# EAGLE design smartwatch class 2_justincase (EAGLE 9.6.2)
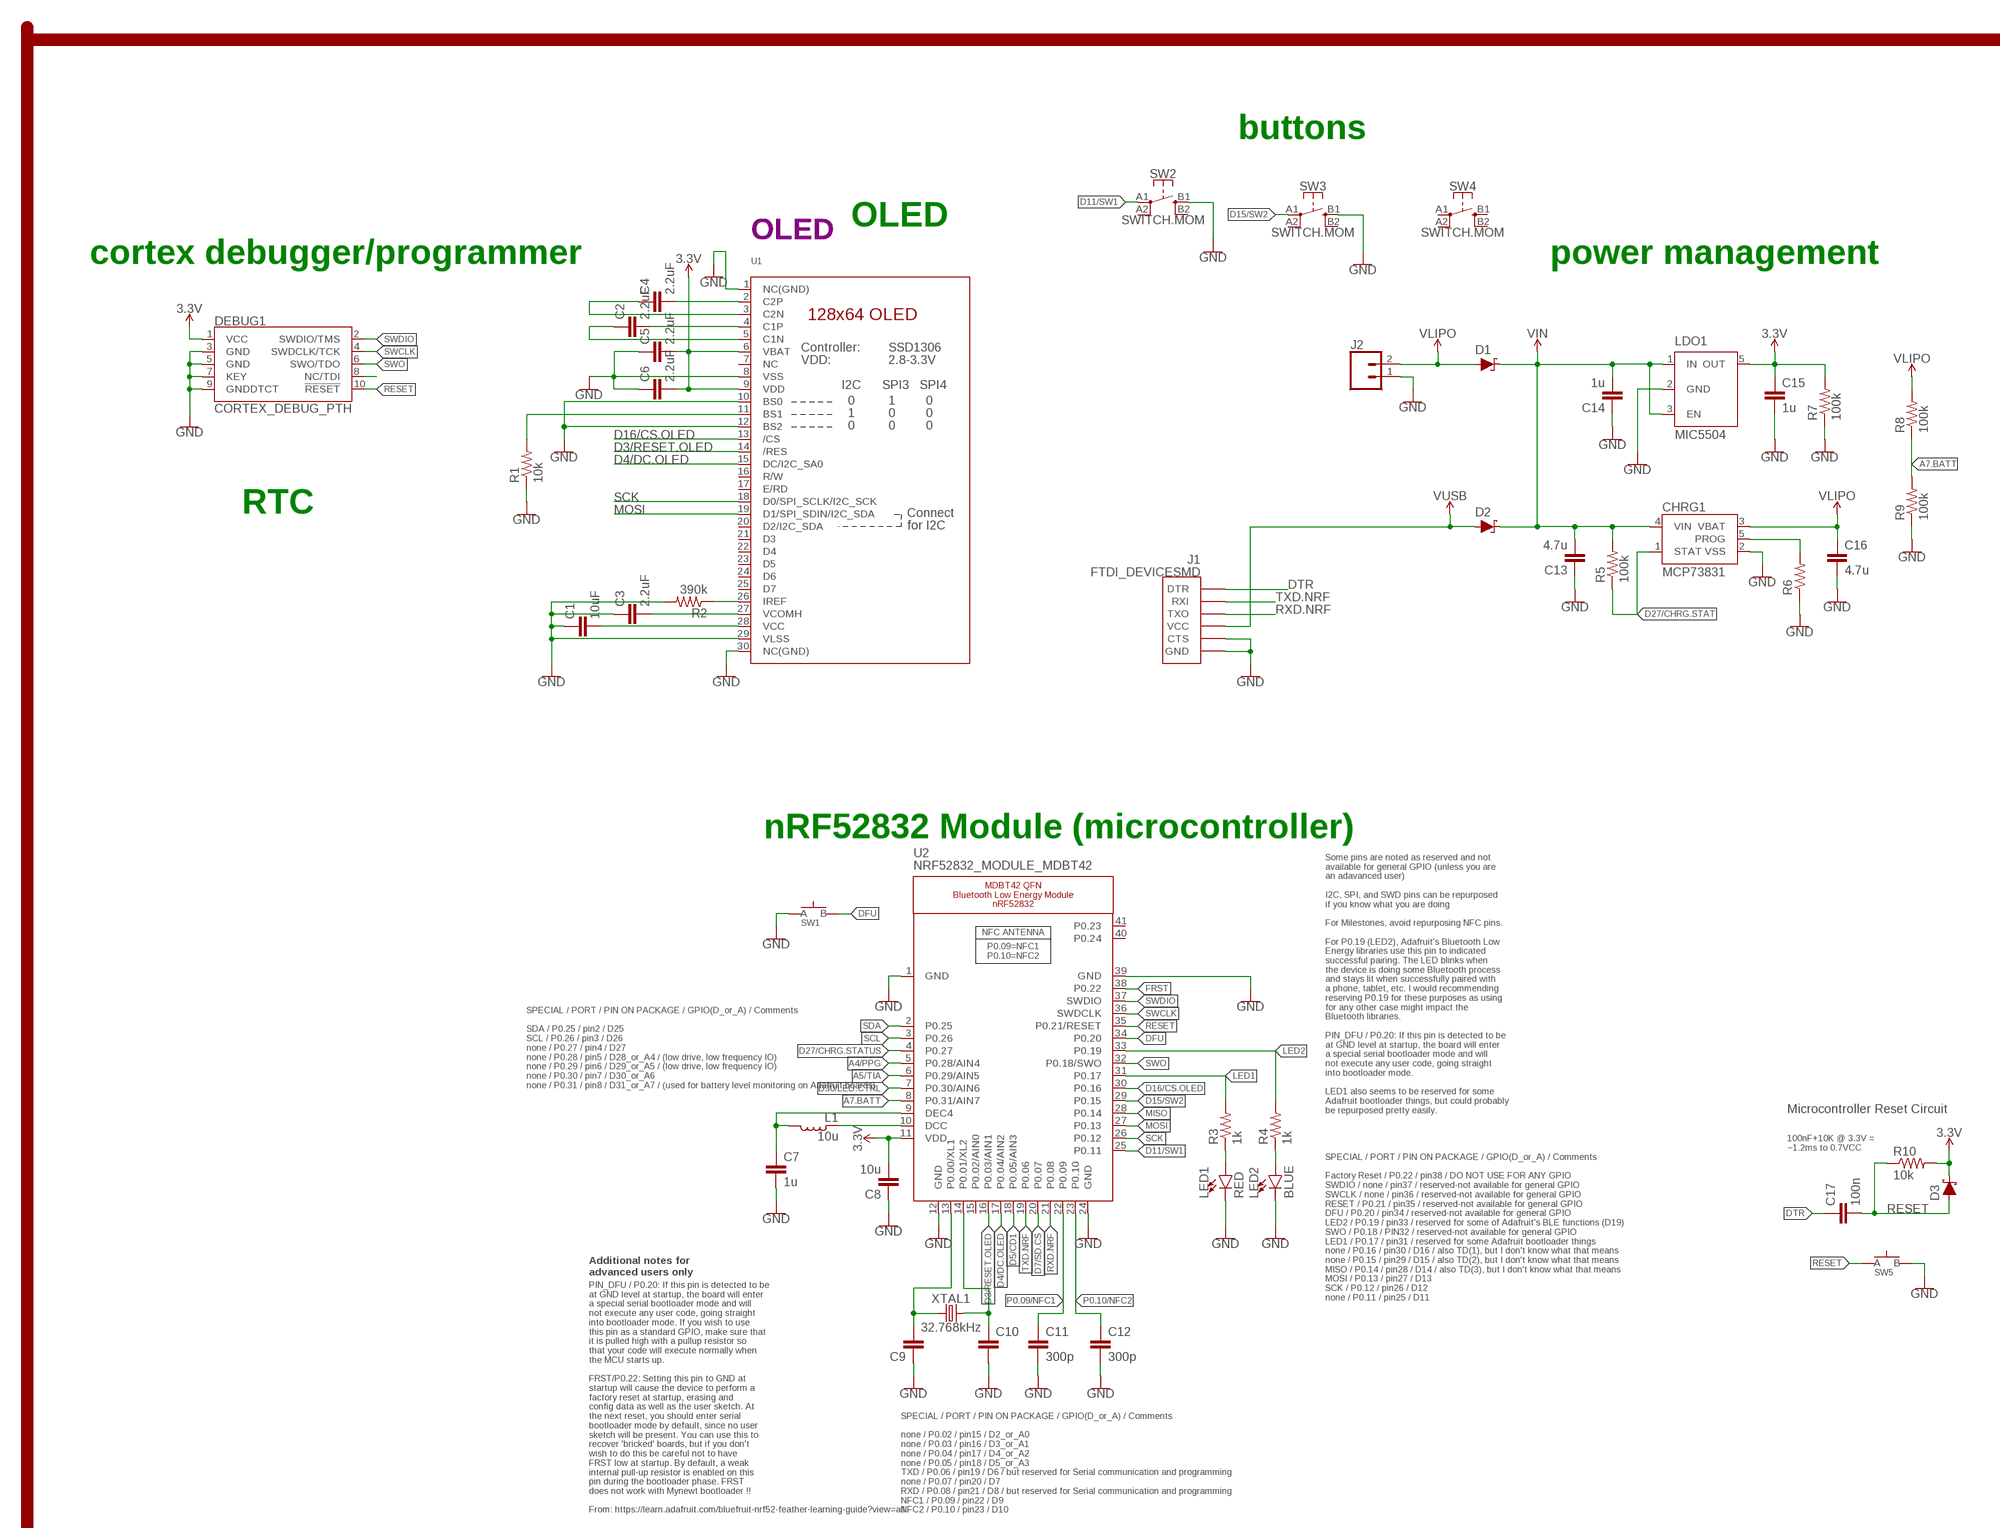
[diagram p0: schematic, sheet 1, part 1 of 2]
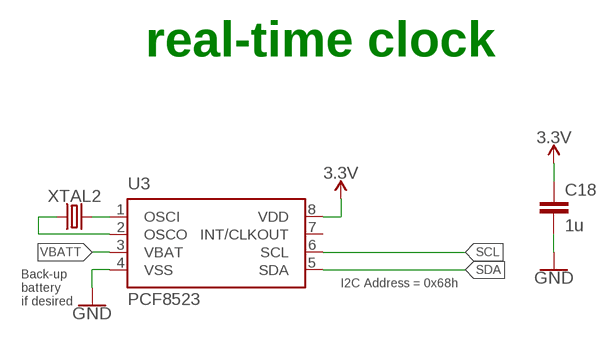
[diagram p1: schematic, sheet 1, part 2 of 2]

## Parts
C1  10uF  CAPACITOR0603  [C0603]
C2  2.2uF  CAPACITOR0603  [C0603]
C3  2.2uF  CAPACITOR0603  [C0603]
C4  2.2uF  CAPACITOR0603  [C0603]
C5  2.2uF  CAPACITOR0603  [C0603]
C6  2.2uF  CAPACITOR0603  [C0603]
C7  1u  CAPACITOR0603  [C0603]
C8  10u  CAPACITOR0805  [C0805]
C9  CAPACITOR0603  [C0603]
C10  CAPACITOR0603  [C0603]
C11  300p  CAPACITOR0603  [C0603]
C12  300p  CAPACITOR0603  [C0603]
C13  4.7u  CAPACITOR0603  [C0603]
C14  1u  CAPACITOR0603  [C0603]
C15  1u  CAPACITOR0603  [C0603]
C16  4.7u  CAPACITOR0603  [C0603]
C17  100n  CAPACITOR0603  [C0603]
C18  1u  CAPACITOR0603  [C0603]
CHRG1  MCP73831  [SOT23-5]
D1  SCHOTTKY-USC  [USC]
D2  SCHOTTKY-USC  [USC]
D3  SCHOTTKY-USC  [USC]
DEBUG1  CORTEX_DEBUG_PTH  [2X5-PTH-1.27MM]
J1  FTDI_DEVICESMD  [FTDI-SMD]
J2  CONN_02  [1X02]
L1  10u  INDUCTOR0603  [L0603]
LDO1  MIC5504  [SOT23-5]
LED1  RED  LED0603  [LED-0603]
LED2  BLUE  LED0603  [LED-0603]
R1  10k  RESISTOR0603  [R0603]
R2  390k  RESISTOR0603  [R0603]
R3  1k  RESISTOR0603  [R0603]
R4  1k  RESISTOR0603  [R0603]
R5  100k  RESISTOR0603  [R0603]
R6  RESISTOR0603  [R0603]
R7  100k  RESISTOR0603  [R0603]
R8  100k  RESISTOR0603  [R0603]
R9  100k  RESISTOR0603  [R0603]
R10  10k  RESISTOR0603  [R0603]
SW1  SPST-PTS830GG140-COPY.1-3  [BUTTON-GULLWING]
SW2  SWITCH.MOM  [TACTILE_SWITCH_SMD_6.2MM_TALL]
SW3  SWITCH.MOM  [TACTILE_SWITCH_SMD_6.2MM_TALL]
SW4  SWITCH.MOM  [TACTILE_SWITCH_SMD_6.2MM_TALL]
SW5  SPST-PTS830GG140-COPY.1-3  [BUTTON-GULLWING]
U1  DISP_OLED_UG-2864HSWEG01-NO-WRAPAROUND  [UG-2864HSWEG01_0.96IN_NO-WRAPAROUND]
U2  NRF52832_MODULE_MDBT42  [BLE_MODULE_RAYTAC_MDBT42]
U3  PCF8523  [SO8]
XTAL1  32.768kHz  CRYSTALECS-.327-12.5-12-C-TR  [2-SMD.NOLEAD.2.0MMTO1.2MM]
XTAL2  32.7680kHz  CRYSTALECS-.327-12.5-12-C-TR  [2-SMD.NOLEAD.2.0MMTO1.2MM]

## Nets
3.3V: C5.2 C6.2 C8.2 C15.1 C18.1 D3.-(C) DEBUG1.1(VCC) LDO1.5(OUT) R7.2 R10.2 U1.6(VBAT) U1.9(VDD) U2.11(VDD) U3.8(VDD)
A4/PPG: U2.5(P0.28/AIN4)
A5/TIA: U2.6(P0.29/AIN5)
A7.BATT: R8.1 R9.2 U2.8(P0.31/AIN7)
D3/RESET.OLED: U1.14(/RES) U2.16(P0.03/AIN1)
D4/DC.OLED: U1.15(DC/I2C_SA0) U2.17(P0.04/AIN2)
D5/CD1: U2.18(P0.05/AIN3)
D7/SD.CS: U2.20(P0.07)
D11/SW1: SW2.A1 U2.25(P0.11)
D15/SW2: SW3.A1 U2.29(P0.15)
D16/CS.OLED: U1.13(/CS) U2.30(P0.16)
D27/CHRG.STAT: CHRG1.1(STAT) R5.1
D27/CHRG.STATUS: U2.4(P0.27)
D30/LED.CTRL: U2.7(P0.30/AIN6)
DFU: SW1.3(B) U2.34(P0.20)
DTR: C17.1 J1.DTR
FRST: U2.38(P0.22)
GND: C1.1 C3.1 C5.1 C6.1 C7.2 C8.1 C9.1 C10.2 C11.2 C12.2 C13.1 C14.1 C15.2 C16.2 C18.2 CHRG1.2(VSS) DEBUG1.3(GND) DEBUG1.5(GND) DEBUG1.7(KEY) DEBUG1.9(GNDDTCT) J1.CTS J1.GND J2.1 LDO1.2(GND) LED1.C LED2.C R1.1 R2.2 R6.1 R7.1 R9.1 SW1.1(A) SW2.B1 SW3.B1 SW5.3(B) U1.1(NC(GND)) U1.8(VSS) U1.10(BS0) U1.12(BS2) U1.29(VLSS) U1.30(NC(GND)) U2.1(GND) U2.12(GND) U2.24(GND) U2.39(GND) U3.4(VSS)
LED1: R3.2 U2.31(P0.17)
LED2: R4.2 U2.33(P0.19)
MISO: U2.28(P0.14)
MOSI: U1.19(D1/SPI_SDIN/I2C_SDA) U2.27(P0.13)
N$1: C9.2 U2.13(P0.00/XL1) XTAL1.P$1
N$2: C10.1 U2.14(P0.01/XL2) XTAL1.P$2
N$3: L1.1 U2.10(DCC)
N$4: R1.2 U1.11(BS1)
N$5: LED1.A R3.1
N$6: R2.1 U1.26(IREF)
N$7: LED2.A R4.1
N$8: C7.1 L1.2 U2.9(DEC4)
N$9: C4.2 U1.2(C2P)
N$10: C4.1 U1.3(C2N)
N$11: C2.2 U1.4(C1P)
N$12: C2.1 U1.5(C1N)
N$13: DEBUG1.8(NC/TDI)
N$14: C1.2 U1.28(VCC)
N$15: C3.2 U1.27(VCOMH)
N$17: CHRG1.5(PROG) R6.2
N$19: U3.2(OSCO) XTAL2.P$1
N$20: U3.1(OSCI) XTAL2.P$2
P0.09/NFC1: C11.1 U2.22(P0.09)
P0.10/NFC2: C12.1 U2.23(P0.10)
RESET: C17.2 D3.+(A) DEBUG1.10(!RESET) R10.1 SW5.1(A) U2.35(P0.21/RESET)
RXD.NRF: J1.TXO U2.21(P0.08)
SCK: U1.18(D0/SPI_SCLK/I2C_SCK) U2.26(P0.12)
SCL: U2.3(P0.26) U3.6(SCL)
SDA: U2.2(P0.25) U3.5(SDA)
SWCLK: DEBUG1.4(SWDCLK/TCK) U2.36(SWDCLK)
SWDIO: DEBUG1.2(SWDIO/TMS) U2.37(SWDIO)
SWO: DEBUG1.6(SWO/TDO) U2.32(P0.18/SWO)
TXD.NRF: J1.RXI U2.19(P0.06)
V_USB: D2.+(A) J1.VCC ; supply symbol labelled VUSB
VBATT: U3.3(VBAT)
VIN: C13.2 C14.2 CHRG1.4(VIN) D1.-(C) D2.-(C) LDO1.1(IN) LDO1.3(EN) R5.2
VLIPO: C16.1 CHRG1.3(VBAT) D1.+(A) J2.2 R8.2
Unconnected: SW2.A2 SW2.B2 SW3.A2 SW3.B2 SW4.A1 SW4.A2 SW4.B1 SW4.B2 U1.7(NC) U1.16(R/W) U1.17(E/RD) U1.20(D2/I2C_SDA) U1.21(D3) U1.22(D4) U1.23(D5) U1.24(D6) U1.25(D7) U2.15(P0.02/AIN0) U2.40(P0.24) U2.41(P0.23) U3.7(INT/CLKOUT)

## Notes on the sheet
- buttons
- OLED
- OLED
- cortex debugger/programmer | power management
- RTC
- real-time clock
- nRF52832 Module (microcontroller)
- I2C Address = 0x68h
- Back-up
  battery
  if desired
- SPECIAL / PORT / PIN ON PACKAGE / GPIO(D_or_A) / Comments
  
  SDA / P0.25 / pin2 / D25
  SCL / P0.26 / pin3 / D26
  none / P0.27 / pin4 / D27
  none / P0.28 / pin5 / D28_or_A4 / (low drive, low frequency IO)
  none / P0.29 / pin6 / D29_or_A5 / (low drive, low frequency IO)
  none / P0.30 / pin7 / D30_or_A6
  none / P0.31 / pin8 / D31_or_A7 / (used for battery level monitoring on Adafruit boards)
- Some pins are noted as reserved and not
  available for general GPIO (unless you are
  an adavanced user)
  
  I2C, SPI, and SWD pins can be repurposed
  if you know what you are doing
  
  For Milestones, avoid repurposing NFC pins.
  
  For P0.19 (LED2), Adafruit's Bluetooth Low
  Energy libraries use this pin to indicated
  successful pairing. The LED blinks when
  the device is doing some Bluetooth process
  and stays lit when successfully paired with
  a phone, tablet, etc. I would recommending
  reserving P0.19 for these purposes as using
  for any other case might impact the
  Bluetooth libraries.
  
  PIN_DFU / P0.20: If this pin is detected to be
  at GND level at startup, the board will enter
  a special serial bootloader mode and will
  not execute any user code, going straight
  into bootloader mode.
  
  LED1 also seems to be reserved for some
  Adafruit bootloader things, but could probably
  be repurposed pretty easily.
- Microcontroller Reset Circuit
- 100nF+10K @ 3.3V =
  ~1.2ms to 0.7VCC
- Additional notes for
  advanced users only
- SPECIAL / PORT / PIN ON PACKAGE / GPIO(D_or_A) / Comments
  
  Factory Reset / P0.22 / pin38 / DO NOT USE FOR ANY GPIO
  SWDIO / none / pin37 / reserved-not available for general GPIO
  SWCLK / none / pin36 / reserved-not available for general GPIO
  RESET / P0.21 / pin35 / reserved-not available for general GPIO
  DFU / P0.20 / pin34 / reserved-not available for general GPIO
  LED2 / P0.19 / pin33 / reserved for some of Adafruit's BLE functions (D19)
  SWO / P0.18 / PIN32 / reserved-not available for general GPIO
  LED1 / P0.17 / pin31 / reserved for some Adafruit bootloader things
  none / P0.16 / pin30 / D16 / also TD(1), but I don't know what that means
  none / P0.15 / pin29 / D15 / also TD(2), but I don't know what that means
  MISO / P0.14 / pin28 / D14 / also TD(3), but I don't know what that means
  MOSI / P0.13 / pin27 / D13
  SCK / P0.12 / pin26 / D12
  none / P0.11 / pin25 / D11
- PIN_DFU / P0.20: If this pin is detected to be
  at GND level at startup, the board will enter
  a special serial bootloader mode and will
  not execute any user code, going straight
  into bootloader mode. If you wish to use
  this pin as a standard GPIO, make sure that
  it is pulled high with a pullup resistor so
  that your code will execute normally when
  the MCU starts up.
  
  FRST/P0.22: Setting this pin to GND at
  startup will cause the device to perform a
  factory reset at startup, erasing and
  config data as well as the user sketch. At
  the next reset, you should enter serial
  bootloader mode by default, since no user
  sketch will be present. You can use this to
  recover 'bricked' boards, but if you don't
  wish to do this be careful not to have
  FRST low at startup. By default, a weak
  internal pull-up resistor is enabled on this
  pin during the bootloader phase. FRST
  does not work with Mynewt bootloader !!
  
  From: https://learn.adafruit.com/bluefruit-nrf52-feather-learning-guide?view=all
- SPECIAL / PORT / PIN ON PACKAGE / GPIO(D_or_A) / Comments
  
  none / P0.02 / pin15 / D2_or_A0
  none / P0.03 / pin16 / D3_or_A1
  none / P0.04 / pin17 / D4_or_A2
  none / P0.05 / pin18 / D5_or_A3
  TXD / P0.06 / pin19 / D6 / but reserved for Serial communication and programming
  none / P0.07 / pin20 / D7
  RXD / P0.08 / pin21 / D8 / but reserved for Serial communication and programming
  NFC1 / P0.09 / pin22 / D9
  NFC2 / P0.10 / pin23 / D10

## Library data of the parts
C1-C18 = LinnesLab-Passives:CAPACITOR
CHRG1 = LinnesLab-Power:MCP73831: MCP73831T Li-Ion, Li-Pol Controller Miniature single cell, fully integrated Li-Ion, Li-polymer charge management controller Datasheet <http://ww1.microchip.com/downloads/en/DeviceDoc/20001984g.pdf> SparkFun Products: SparkFun ESP32 Thing <https://www.sparkfun.com/products/13907> SparkFun 9DoF Razor IMU M0 <https://www.sparkfun.com/products/14001>; PROD_ID: IC-09995
D1-D3 = LinnesLab-DiscreteSemi:SCHOTTKY: Schottky diode A Schottky diode is a semiconductor diode which has a low forward voltage drop and a very fast switching action. Example: Digi-Key Part Number: RB161MM-20CT-ND
DEBUG1 = LinnesLab-Connectors:CORTEX_DEBUG: Cortex Debug Connector - 10 pin Supports JTAG debug, Serial Wire debug, and Serial Wire Viewer. PTH and SMD connector options available. General Connector Information <http://infocenter.arm.com/help/topic/com.arm.doc.faqs/attached/13634/cortex_debug_connectors.pdf> Products: PTH Connector <http://www.digikey.com/product-detail/en/cnc-tech/3220-10-0100-00/1175-1627-ND/3883661> -via Digi-Key SparkFun PSoc <https://www.sparkfun.com/products/13229> SparkFun T <https://www.sparkfun.com/products/13810>
J1 = LinnesLab-Connectors:FTDI_DEVICE
J2 = LinnesLab-Connectors:CONN_02: Multi connection point. Often used as Generic Header-pin footprint for 0.1 inch spaced/style header connections On any of the 0.1 inch spaced packages, you can populate with these: Break Away Headers - Straight <https://www.sparkfun.com/products/116> (PRT-00116) Break Away Male Headers - Right Angle <https://www.sparkfun.com/products/553> (PRT-00553) Female Headers <https://www.sparkfun.com/products/115> (PRT-00115) Break Away Headers - Machine Pin <https://www.sparkfun.com/products/117> (PRT-00117) Break Away Female Headers - Swiss Machine Pin <https://www.sparkfun.com/products/743> (PRT-00743) For SCREWTERMINALS and SPRING TERMINALS visit here: Screw Terimnals on SparkFun.com <https://www.sparkfun.com/search/results?term=Screw+Terminals> (5mm/3.5mm/2.54mm spacing) This device is also useful as a general connection point to wire up your design to another part of your project. Our various solder wires solder well into these plated through hole pads. Hook-Up Wire - Assortment (Stranded, 22 AWG) <https://www.sparkfun.com/products/11375> (PRT-11375) Hook-Up Wire - Assortment (Solid Core, 22 AWG) <https://www.sparkfun.com/products/11367> (PRT-11367) View the entire wire category on our website here <https://www.sparkfun.com/categories/141> Special notes: Molex polarized connector foot print use with: PRT-08233 with associated crimp pins and housings. 2.54_SCREWTERM for use with PRT-10571. 3.5mm Screw Terminal footprints for PRT-08084 5mm Screw Terminal footprints for use with PRT-08432
L1 = LinnesLab-Passives:INDUCTOR
LDO1 = LinnesLab-Power:MIC5504: MIC5504 Voltage Regulator Output Voltages: 1.0V to 3.3V Input Voltages: 2.5V to 5.5V Link to Datasheet http://ww1.microchip.com/downloads/en/DeviceDoc/MIC550X.pdf
LED1 LED2 = LinnesLab-LED:LED: LED (Generic) Standard schematic elements and footprints for 5mm, 3mm, 1206, and 0603 sized LEDs. Generic LEDs with no color specified. LTST-C190KGKT: arrow indicates cathode
R1-R10 = LinnesLab-Passives:RESISTOR
SW1 SW5 = LinnesLab-Switches:SPST-PTS830GG140-COPY
SW2-SW4 = LinnesLab-Switches:SWITCH.MOM: PTS645SM43SMTR92 LFS
U1 = LinnesLab-Displays:DISP_OLED_UG-2864HSWEG01: UG-2864HSWEG01 OLED display Both 1.3" and 0.96" models share the same FPC tab footprint, only the screen dimensions vary.
U2 = LinnesLab-Microcontrollers:NRF52832_MODULE_MDBT42: MDBT42 - BLE Module (nRF52832 QFN) VDD: 1.7-3.6V
U3 = LinnesLab-Clocks:PCF8523; DIGIKEY: 568-5306-1-ND; I2C_ADDRESS: 0x68h; MFN: PCF8523T/1,118; MFN_MANUFACTURER: NXP USA Inc.
XTAL1 XTAL2 = LinnesLab-Clocks:CRYSTAL; DIGIKEY: XC2288CT-ND; FREQ: 32.7680KHZ; LOAD_CAP: 12.5pF

## Board
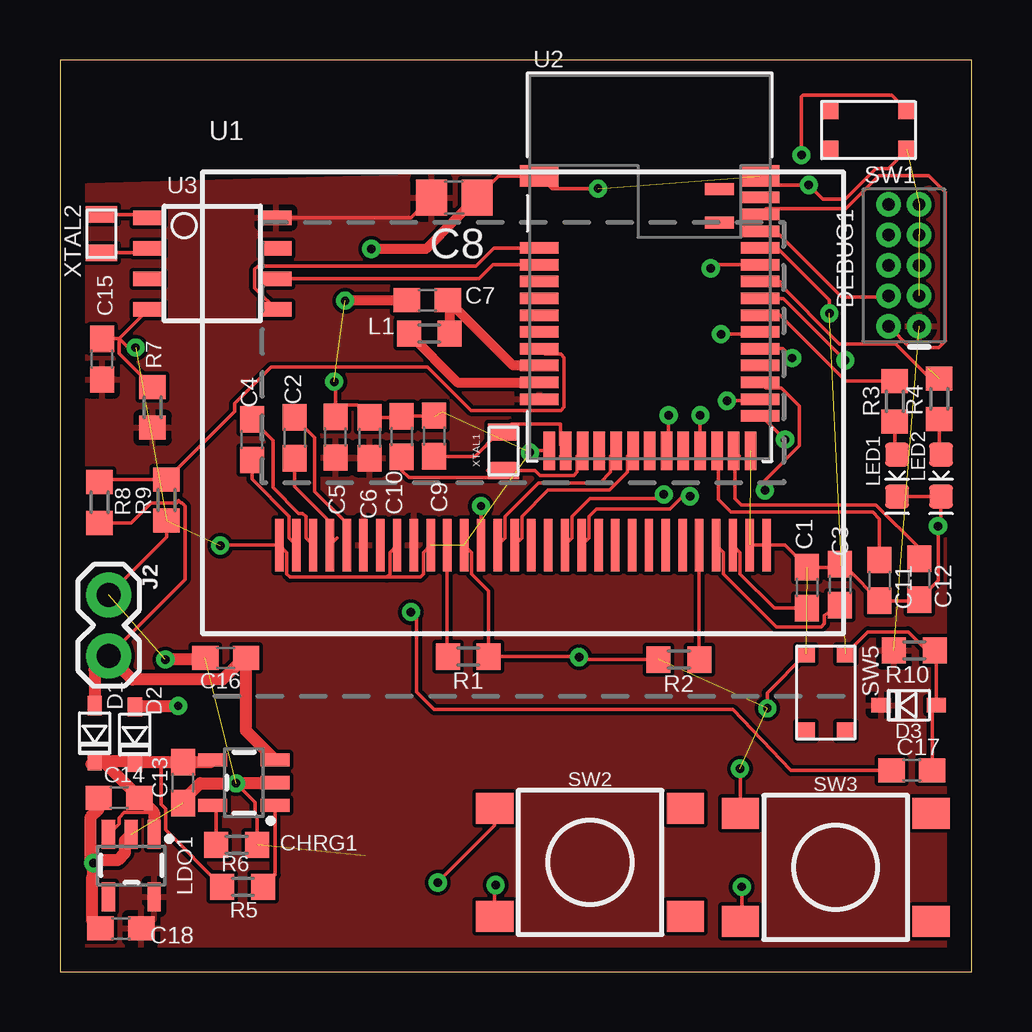
[diagram p2: board, top side]
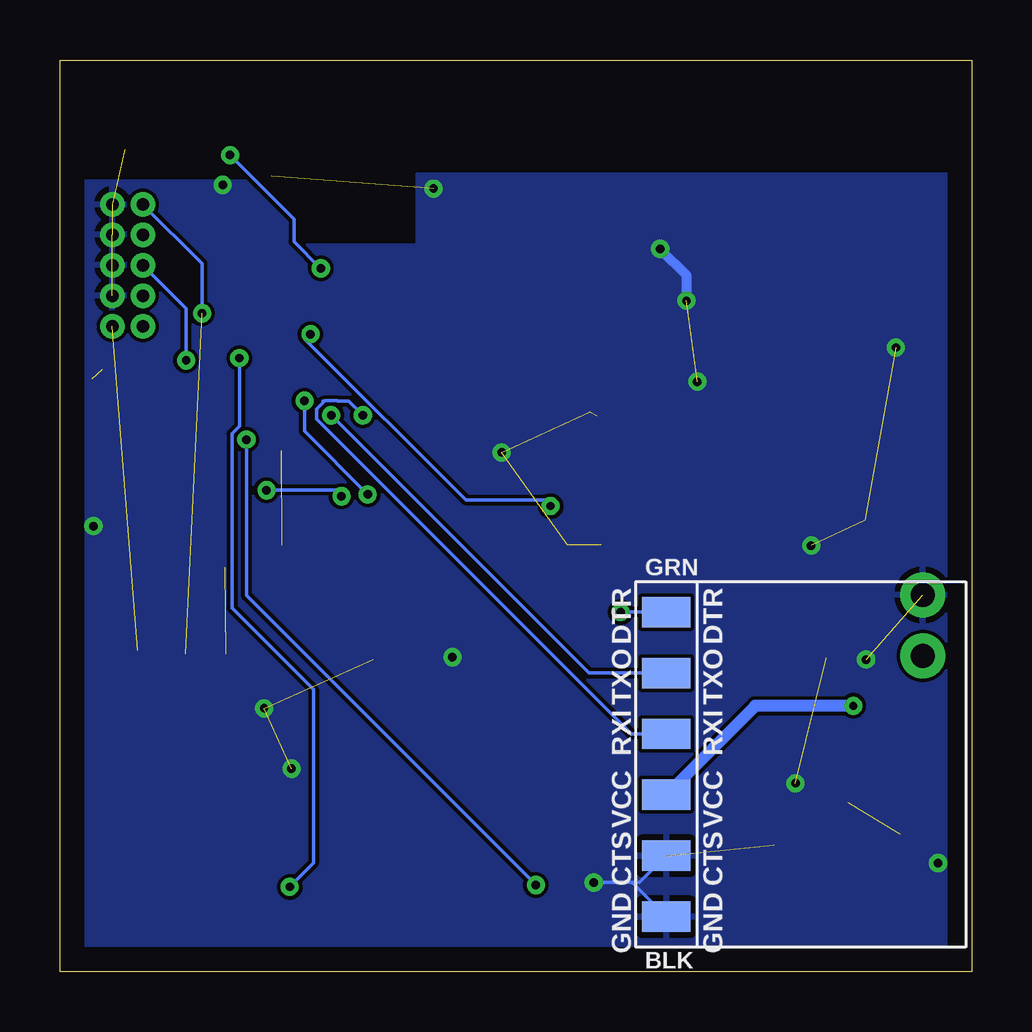
[diagram p3: board, bottom side, seen from below]

Size 38 x 38 mm. Coordinates in mm from the lower left corner, seen from the top.
Outline: 0,0 38,0 38,38 0,38 0,0
Copper layers (1*16): Top 0.035mm / dielectric 1.5mm / Bottom 0.035mm
Design rules "default": minimum track width 6mil, minimum drill 0.35mm, track to track 6mil, track to pad 6mil, pad to pad 6mil, via to via 6mil, smd to smd 6mil, copper to edge 40mil, drill to drill 6mil, minimum pad ring 10mil, minimum via ring 8mil, stop-mask expansion 4mil, vias tented up to drill 0mil, thermal gap 10mil

### Footprints (pad centres in the part's own frame; a part is rotated, then mirrored left to right if it is on the bottom)
C0603 = smd 1.1 x 1: 1 -0.85,0; 2 0.85,0
C0805 = smd 1.3 x 1.5: 1 -0.95,0; 2 0.95,0
SOT23-5 = smd 0.55 x 1.2: 1 -0.95,-1.3; 2 0,-1.3; 3 0.95,-1.3; 4 0.95,1.3; 5 -0.95,1.3
USC = smd 0.8 x 0.6: + -1.15,0; - 1.15,0
2X5-PTH-1.27MM = drill 0.508 pad 1: 1 -2.54,-0.635; 2 -2.54,0.635; 3 -1.27,-0.635; 4 -1.27,0.635; 5 0,-0.635; 6 0,0.635; 7 1.27,-0.635; 8 1.27,0.635; 9 2.54,-0.635; 10 2.54,0.635
FTDI-SMD = smd 1.27 x 2.03: CTS 3.81,0; DTR -6.35,0; GND 6.35,0; RXI -1.27,0; TXO -3.81,0; VCC 1.27,0
1X02 = drill 1.016 pad 1.88: 1 0,0; 2 2.54,0
L0603 = smd 1 x 1.1: 1 -0.85,0; 2 0.85,0
LED-0603 = smd 1 x 1: A -0.877,0; C 0.877,0
R0603 = smd 1 x 1.1: 1 -0.85,0; 2 0.85,0
BUTTON-GULLWING = smd 0.7 x 0.75: 1 -1.6,0.825; 2 1.6,0.825; 3 -1.6,-0.825; 4 1.6,-0.825
TACTILE_SWITCH_SMD_6.2MM_TALL = smd 1.55 x 1.3: A1 -3.975,-2.25; A2 3.975,-2.25; B1 -3.975,2.25; B2 3.975,2.25
UG-2864HSWEG01_0.96IN_NO-WRAPAROUND = smd 0.35 x 2.2: 1 -10.15,-1.2; 2 -9.45,-1.2; 3 -8.75,-1.2; 4 -8.05,-1.2; 5 -7.35,-1.2; 6 -6.65,-1.2; 7 -5.95,-1.2; 8 -5.25,-1.2; 9 -4.55,-1.2; 10 -3.85,-1.2; 11 -3.15,-1.2; 12 -2.45,-1.2; 13 -1.75,-1.2; 14 -1.05,-1.2; 15 -0.35,-1.2; 16 0.35,-1.2; 17 1.05,-1.2; 18 1.75,-1.2; 19 2.45,-1.2; 20 3.15,-1.2; 21 3.85,-1.2; 22 4.55,-1.2; 23 5.25,-1.2; 24 5.95,-1.2; 25 6.65,-1.2; 26 7.35,-1.2; 27 8.05,-1.2; 28 8.75,-1.2; 29 9.45,-1.2; 30 10.15,-1.2
BLE_MODULE_RAYTAC_MDBT42 = smd 1.6 x 0.9: 1 -4.6,3.8; 39 4.6,3.8 | smd 1.6 x 0.48: 2 -4.6,0.8; 3 -4.6,0.1; 4 -4.6,-0.6; 5 -4.6,-1.3; 6 -4.6,-2; 7 -4.6,-2.7; 8 -4.6,-3.4; 9 -4.6,-4.1; 10 -4.6,-4.8; 11 -4.6,-5.5; 25 4.6,-6.2; 26 4.6,-5.5; 27 4.6,-4.8; 28 4.6,-4.1; 29 4.6,-3.4; 30 4.6,-2.7; 31 4.6,-2; 32 4.6,-1.3; 33 4.6,-0.6; 34 4.6,0.1; 35 4.6,0.8; 36 4.6,1.5; 37 4.6,2.2; 38 4.6,2.9 | smd 0.48 x 1.6: 12 -4.2,-7.65; 13 -3.5,-7.65; 14 -2.8,-7.65; 15 -2.1,-7.65; 16 -1.4,-7.65; 17 -0.7,-7.65; 18 0,-7.65; 19 0.7,-7.65; 20 1.4,-7.65; 21 2.1,-7.65; 22 2.8,-7.65; 23 3.5,-7.65; 24 4.2,-7.65 | smd 1.2 x 0.5: 40 2.9,3.25; 41 2.9,1.85
SO8 = smd 1.3 x 0.6: 1 -2.65,1.905; 2 -2.65,0.635; 3 -2.65,-0.635; 4 -2.65,-1.905; 5 2.65,-1.905; 6 2.65,-0.635; 7 2.65,0.635; 8 2.65,1.905
2-SMD.NOLEAD.2.0MMTO1.2MM = smd 0.7 x 1.3: P$1 -0.8,0; P$2 0.8,0

### Placement (x,y rotation side)
C1  31.14,16 270 top
C2  9.78,22.25 270 top
C3  32.51,16.13 270 top
C4  8,22.17 270 top
C5  11.48,22.28 270 top
C6  12.9,22.25 270 top
C7  15.32,27.99 180 top
C8  16.43,32.26 180 top
C9  15.6,22.33 270 top
C10  14.25,22.3 90 top
C11  34.16,16.31 270 top
C12  35.81,16.36 270 top
C13  5.13,7.87 90 top
C14  2.46,7.24 0 top
C15  1.75,25.53 90 top
C16  6.91,13.08 180 top
C17  35.51,8.38 0 top
C18  2.54,1.8 180 top
CHRG1  7.67,7.87 90 top
D1  1.45,9.93 270 top
D2  3.12,9.88 270 top
D3  35.38,11.1 180 top
DEBUG1  35.18,29.44 90 top
J1  12.73,8.64 270 bottom
J2  2.03,15.7 270 top
L1  15.39,26.59 0 top
LDO1  2.97,4.42 180 top
LED1  34.9,20.68 270 top
LED2  36.73,20.68 270 top
R1  17.02,13.13 180 top
R2  25.81,13 180 top
R3  34.8,23.77 90 top
R4  36.65,23.88 90 top
R5  7.62,3.53 180 top
R6  7.37,5.28 180 top
R7  3.86,23.52 270 top
R8  1.65,19.56 270 top
R9  4.45,19.66 90 top
R10  35.61,13.39 180 top
SW1  33.71,35.08 180 top
SW2  22.1,4.55 0 top
SW3  32.33,4.34 0 top
SW4  38.71,-6.99 0 top  (outside the outline)
SW5  31.93,11.63 270 top
U1  19.3,18.97 0 top
U2  24.59,29.36 0 top
U3  6.35,29.51 0 top
XTAL1  18.49,21.69 270 top
XTAL2  1.73,30.76 90 top

### Tracks (layer width: path | path; a pad name or v marks a point on that pad's centre or on a via)
3.3V  (1 unrouted)
  Top 0.152: C8.2 14.65,31.42 U3.8
  pour Top: 23.24,33.41 23.24,30.35 28.17,30.35 37.82,33.17 37.82,0.41 0.28,0.41 0.36,32.79
A7.BATT
  Top 0.152: R8.1 1.75,20.51 R9.2 7.27,23.34 7.27,23.67 8.8,25.19 15.33,25.19 17.13,23.39 20.88,23.39 21.02,23.53 21.02,25.6 20.88,25.73 20.22,25.73 U2.8
D3/RESET.OLED
  Top 0.152: U1.14 18.55,18.07 18.55,18.97 19.95,20.37 22.51,20.37 22.96,20.82 22.96,21.48 U2.16
D4/DC.OLED
  Top 0.152: U2.17 23.66,21.48 23.66,20.82 22.91,20.07 20.35,20.07 19.25,18.97 19.25,18.07 U1.15
D11/SW1  (via drill 0.35)
  Top 0.152: SW2.A1 18.12,3.57 v18.16,3.61 | v30.23,22.17 29.24,23.16 U2.25
  Bottom 0.152: v18.16,3.61 30.23,15.67 v30.23,22.17
D15/SW2  (via drill 0.35)
  Top 0.152: U2.29 30.13,25.96 v30.52,25.57 | v28.42,3.53 28.42,2.16 SW3.A1
  Bottom 0.152: v30.52,25.57 30.52,22.74 30.83,22.43 30.83,15.16 27.43,11.76 27.43,4.52 v28.42,3.53
D16/CS.OLED  (via drill 0.35)
  Top 0.152: U1.13 v17.55,19.4 v17.55,19.41 | v27.56,26.57 29.09,26.57 U2.30
  Bottom 0.152: v17.55,19.41 17.8,19.66 21.08,19.66 27.77,26.35 v27.56,26.57
D27/CHRG.STAT
  Top 0.152: R5.1 8.97,4.03 CHRG1.1
DFU  (via drill 0.35)
  Top 0.152: 29.85,29.46 U2.34 27.28,29.46 v27.13,29.31 | SW1.3 34.68,36.52 30.96,36.52 30.91,36.47 v30.91,34.04
  Bottom 0.152: v30.91,34.04 28.25,31.37 28.25,30.43 v27.13,29.31
DTR  (via drill 0.35)
  Top 0.152: v14.63,14.99 14.86,14.76 14.86,11.66 15.6,10.92 28.05,10.92 30.47,8.38 C17.1
  Bottom 0.152: J1.DTR v14.63,14.99
GND  (via drill 0.35)  (20 unrouted)
  Top 0.152: LED1.C LED2.C 36.73,18.69 v36.61,18.57 36.61,16.3 C12.2 35.76,15.46 C11.2 32.84,16.78 C3.1 32.44,16.85 C1.1 30.22,17.77 U1.30 U1.29 | U2.39 29.19,33.12 29.51,32.79 v31.22,32.79 31.8,32.21 32.74,32.21 34.01,33.48 34.53,33.48 SW1.1 | v22.43,32.64 20.51,32.64 U2.1 18.29,33.16 C8.1 | 15.62,23.15 C9.1 15.57,23.15 | C6.1 12.88,23.07 | 15.93,23.33 16.02,23.23 15.94,23.15 C10.2 14.2,23.1 C6.1 | U2.12 19.66,21.71 v19.59,21.64 | C6.1 12.39,23.61 11.96,23.61 C5.1 11.48,24.54 v11.43,24.59 | R6.1 8.22,6.48 8.14,6.55 8.14,7.05 v7.34,7.85 | J2.1 4.45,18.11 R9.1 | R2.2 21.74,13.01 v21.64,13.11 21.61,13.13 R1.1 17.87,15.86 17.15,16.58 17.15,17.48 U1.12 | 13.62,16.45 13.76,16.58 13.76,17.48 U1.8 | 13.62,16.45 9.58,16.45 9.45,16.58 9.45,17.48 U1.1 6.7,17.77 v6.68,17.75 | U1.10 15.16,17.48 15.16,16.58 15.02,16.45 13.62,16.45 | SW5.3 29.49,11.62 v29.49,10.97 | SW3.B1 28.36,8.45 v28.35,8.46 | SW2.B1 18.12,6.08 v15.75,3.71 | U3.4 2.47,26.38 | 2.47,26.38 C15.2 | R7.1 2.47,25.76 2.47,26.38 | 2.47,26.38 2.83,26.01 v3.15,26.01
  Top 0.406: C8.1 16.49,31.36 15.25,30.12 v12.98,30.12 | v11.89,27.96 11.91,27.99 C7.2
  Top 0.508: C14.1 1.61,6.76 1.27,6.42 1.27,4.64 | 1.27,4.64 v1.39,4.52 1.39,3.94 1.34,3.89 1.34,2.15 C18.2 | C16.2 5.98,13.01 v4.39,13.01 | C13.1 5.36,7.26 5.36,7.37 5.85,7.85 v7.34,7.85 8.95,7.85 CHRG1.2 | LDO1.2 2.7,5.45 2.7,4.95 2.4,4.64 1.27,4.64
  Bottom 0.152: J1.CTS 13.84,3.71 v15.75,3.71 14.15,3.71 J1.GND
  Bottom 0.406: v12.98,30.12 11.89,29.03 v11.89,27.96
  pour Bottom: 23.11,33.25 23.11,30.28 28.17,30.28 28.17,32.94 37.64,32.94 37.64,32.92 37.64,0.46 0.53,0.46 0.53,33.25
LED1
  Top 0.152: U2.31 30.02,27.36 32.75,24.62 R3.2
LED2  (1 unrouted)
  Top 0.152: 36.2,25.12 36.22,25.12 | 30.01,28.76 U2.33 29.9,28.76 32.5,26.16 34.85,26.16 36.29,24.73 R4.2
MOSI  (via drill 0.35)
  Top 0.152: U1.19 22.05,18.07 22.05,18.97 22.36,19.28 25.42,19.28 25.95,19.81 v26.26,19.81 | U2.27 29.42,24.33 30.08,24.33 30.83,23.58 30.83,21.92 29.39,20.48 v29.39,20.06
  Bottom 0.152: v26.26,19.81 26.52,20.06 v29.39,20.06
N$1
  Top 0.152: 20.86,21.48 U2.13 20.86,21.94 20.86,22.82 18.82,22.82 XTAL1.P$1 18.31,22.49 17.3,21.48 C9.2
N$2
  Top 0.152: U2.14 21.56,21.48 21.56,20.82 21.42,20.68 20.02,20.68 19.81,20.89 XTAL1.P$2 | 14.38,21.32 C10.1 14.25,20.89 14.54,20.6 18.2,20.6 XTAL1.P$2 | 17.83,20.89 XTAL1.P$2
N$3
  Top 0.406: L1.1 16.57,24.56 U2.10
N$4
  Top 0.152: U1.11 16.15,13.15 R1.2
N$5
  Top 0.152: R3.1 34.8,21.65 LED1.A
N$6
  Top 0.152: R2.1 26.65,13.02 U1.26
N$7
  Top 0.152: R4.1 36.65,21.63 LED2.A
N$8
  Top 0.152: U2.9 19.73,25.26 | 16.25,27.91 18.89,25.26 | 16.25,27.91 C7.1 | L1.2 16.24,27.9 16.25,27.91
  Top 0.406: U2.9 18.89,25.26 C7.1 16.24,27.91 L1.2
N$9
  Top 0.152: U1.2 9.56,18.07 9.56,18.97 8,20.52 C4.2
N$10
  Top 0.152: C4.1 8.89,22.14 8.89,20.17 9.96,19.1 10.12,19.1 10.26,18.97 10.26,18.07 U1.3
N$11
  Top 0.152: 11.55,18.07 U1.4 11.25,18.74 9.78,20.22 C2.2
N$12
  Top 0.152: C2.1 10.62,22.26 10.62,20.01 11.86,18.77 11.86,17.87 U1.5
N$14
  Top 0.152: U1.28 28.35,17.48 28.35,16.58 29.78,15.15 C1.2
N$15
  Top 0.152: U1.27 27.65,17.48 27.65,16.58 29.86,14.37 31.73,14.37 31.87,14.51 31.87,14.84 C3.2
N$17
  Top 0.152: CHRG1.5 6.52,6.78 R6.2
N$19
  Top 0.152: XTAL2.P$1 3.51,29.96 U3.2
N$20
  Top 0.152: XTAL2.P$2 3.56,31.56 U3.1
P0.09/NFC1
  Top 0.152: U2.22 27.44,21.66 27.44,19.68 27.96,19.15 33.88,19.15 34.16,18.87 C11.1
P0.10/NFC2
  Top 0.152: U2.23 28.11,21.68 | C12.1 35.81,17.65 34.01,19.46 28.4,19.46 28.14,19.71 28.14,21.66 U2.23 | U2.23 28.32,21.48
RESET  (via drill 0.35)  (1 unrouted)
  Top 0.152: v32.08,27.44 32.08,27.99 29.9,30.16 U2.35 | C17.2 36.36,10.93 D3.+ 36.53,13.31 R10.1 36.13,13.39 35.35,14.16 33.68,14.16 SW5.1
  Bottom 0.152: v32.08,27.44 32.08,29.51 DEBUG1.10
RXD.NRF  (via drill 0.35)
  Top 0.152: U2.21 26.69,23.18 v26.7,23.19
  Bottom 0.152: v26.7,23.19 15.95,12.45 J1.TXO
SCK  (via drill 0.35)
  Top 0.152: v25.17,19.89 25.17,19.84 25.04,19.71 22.09,19.71 21.35,18.97 21.35,18.07 U1.18 | v27.81,23.79 29.12,23.79 U2.26
  Bottom 0.152: v25.17,19.89 27.81,22.52 v27.81,23.79
SCL
  Top 0.152: U3.6 17.48,28.88 18.06,29.46 U2.3
SDA
  Top 0.152: U3.5 8.26,28.35 8.12,28.48 8.12,29.27 8.26,29.41 17.34,29.41 18.1,30.16 U2.2
SWCLK
  Top 0.152: U2.36 29.84,30.86 32.6,28.11 34.48,28.11 DEBUG1.4
SWDIO
  Top 0.152: U2.37 29.42,31.79 32.75,31.79 34.13,33.17 36.22,33.17 36.91,32.49 36.91,26.29 36.63,26.01 35.43,26.01 DEBUG1.2
SWO  (via drill 0.35)
  Top 0.152: U2.32 30.15,28.06 v32.74,25.48
  Bottom 0.152: v32.74,25.48 32.74,27.64 DEBUG1.6
TXD.NRF  (via drill 0.35)
  Top 0.152: v25.38,23.19 25.38,21.8 U2.19
  Bottom 0.152: J1.RXI 14.17,9.91 27.3,23.04 27.3,23.44 27.03,23.72 27.03,23.77 26.97,23.77 26.95,23.8 26.44,23.8 26.42,23.77 25.96,23.77 v25.38,23.19
V_USB  (via drill 0.35)
  Top 0.508: D2.+ 3.17,11.07 v4.93,11.07
  Bottom 0.508: v4.93,11.07 9.02,11.07 J1.VCC
VIN
  Top 0.152: LDO1.3 2.47,6.17 2.47,6.41 2.69,6.63 3.92,6.63 | 4.22,8.72 4.22,6.96 4.4,6.77 4.4,5.9 R5.2
  Top 0.508: 1.32,8.65 D1.- | D1.- 1.77,8.78 C14.2 3.92,6.63 LDO1.1 | D1.- 3.07,8.78 D2.- 4.22,8.72 C13.2 6.27,8.72 CHRG1.4
VLIPO
  Top 0.152: R8.2 2.97,18.71 3.8,19.54 4.86,19.54 4.95,19.63 5.05,19.54 5.09,19.54 5.22,19.4 5.22,16.35 J2.2
  Top 0.508: D1.+ 1.45,12.57 J2.2 3.02,12.18 6.78,12.18 7.68,13.08 C16.1 7.76,10.04 CHRG1.3